# EAGLE design CC3000_WiFi_Shield (EAGLE 6.5.0)
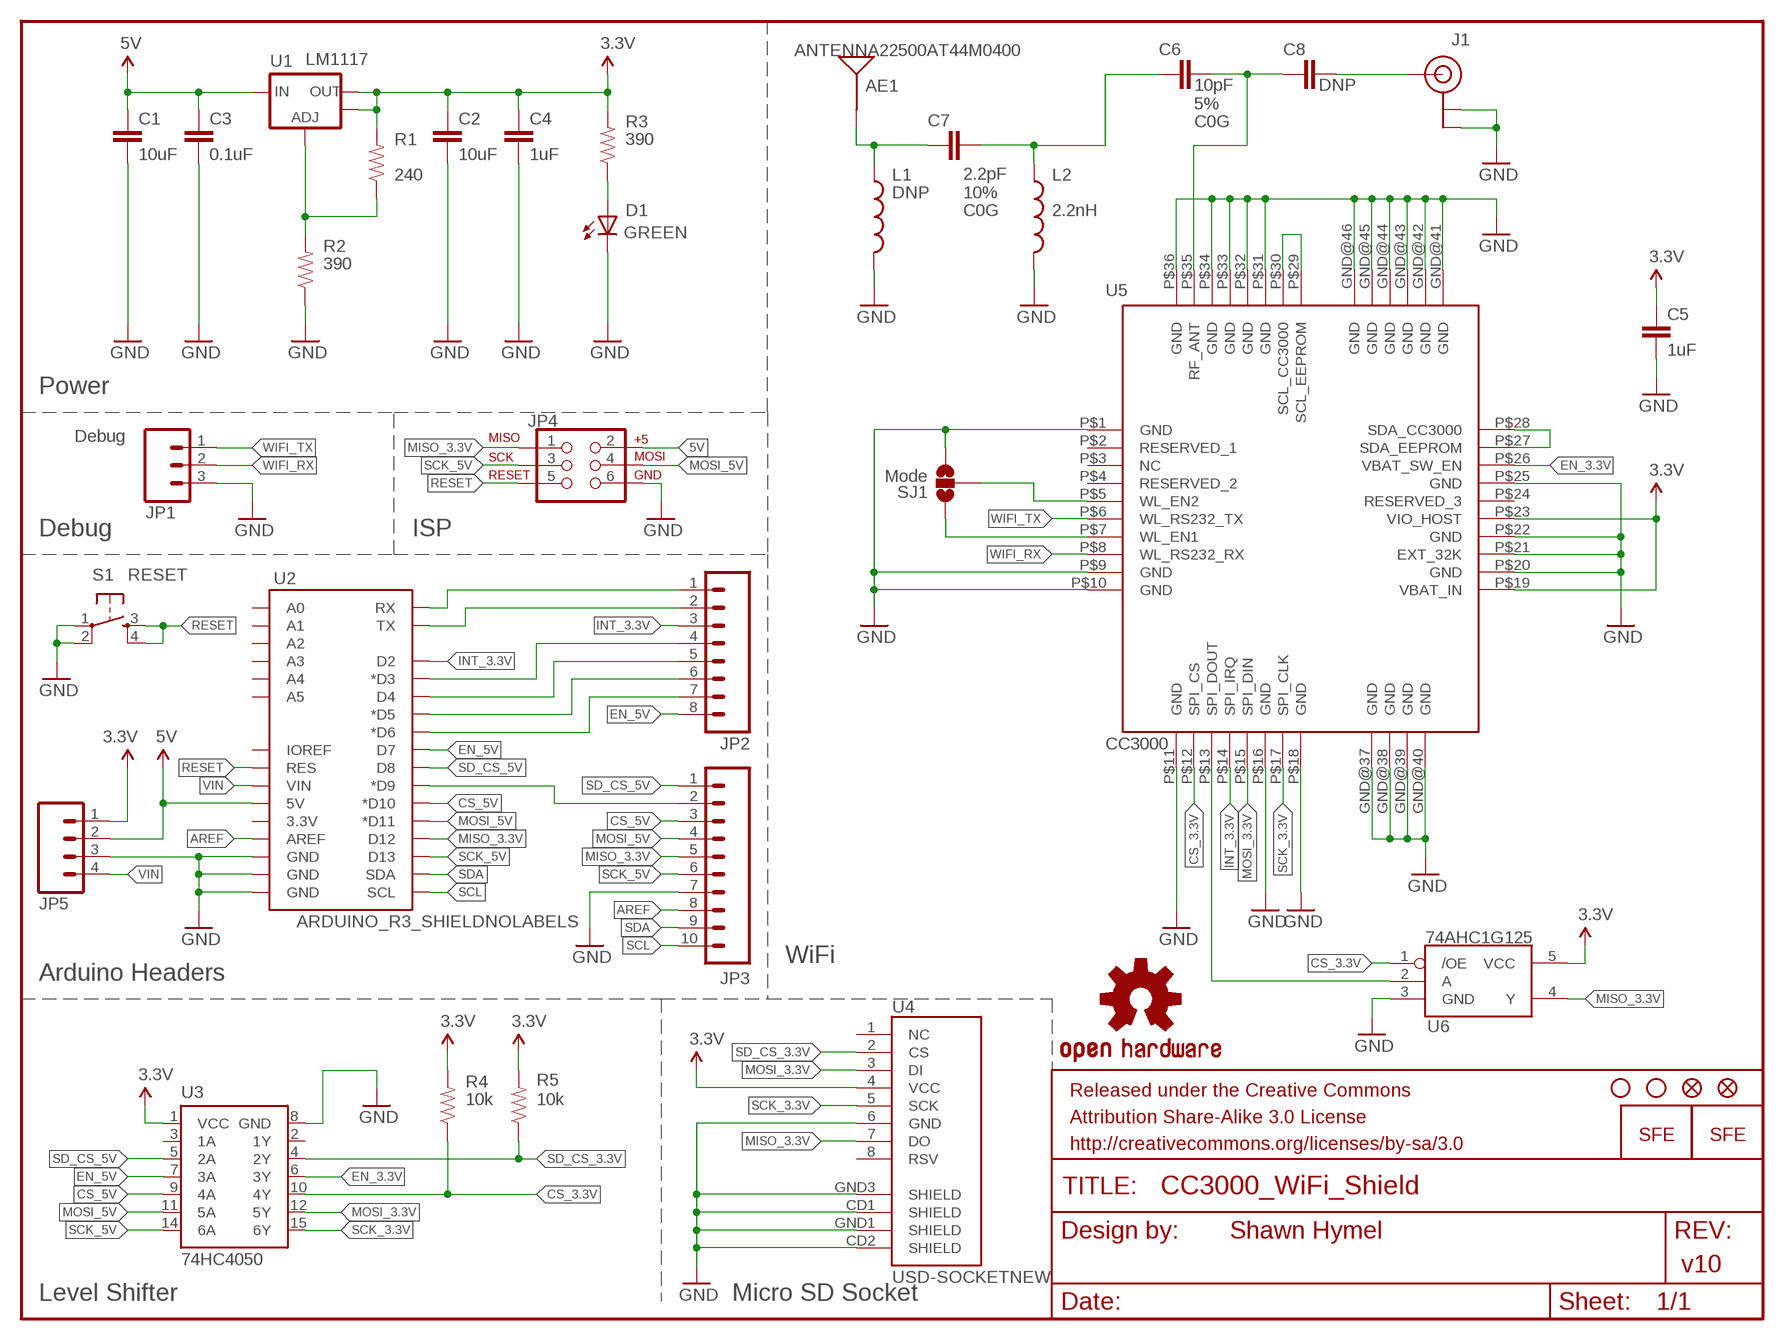
[diagram p0: schematic, sheet 1]

## Parts
AE1  ANTENNA22500AT44M0400  [ANTENNA-CHIP_2500AT44M0400]
C1  10uF  CAP0805  [0805]
C2  10uF  CAP0805  [0805]
C3  0.1uF  CAP0603-CAP  [0603-CAP]
C4  1uF  CAP0805  [0805]
C5  1uF  CAP0805  [0805]
C6  10pF  CAP0603-CAP  [0603-CAP]
C7  2.2pF  CAP0603-CAP  [0603-CAP]
C8  DNP  CAP0603-CAP  [0603-CAP]
D1  GREEN  LED-GREEN0603  [LED-0603]
FID1  FIDUCIAL1X2  [FIDUCIAL-1X2]
FID2  FIDUCIAL1X2  [FIDUCIAL-1X2]
FRAME1  FRAME-LETTER  [CREATIVE_COMMONS]
J1  U.FL  [U.FL]
JP1  Debug  M03PTH  [1X03]
JP2  M08NO_SILK  [1X08_NO_SILK]
JP3  M10NO_SILK  [1X10_NO_SILK]
JP4  AVR_SPI_PRG_6PTH  [2X3]
JP5  M04PTH  [1X04]
L1  DNP  INDUCTOR0603  [0603]
L2  2.2nH  INDUCTOR0603  [0603]
LOGO1  OSHW-LOGOS  [OSHW-LOGO-S]
LOGO2  LOGO-SFENEW  [SFE-NEW-WEBLOGO]
LOGO3  LOGO-SFESK  [SFE-LOGO-FLAME]
R1  240  RESISTOR0603  [0603-RES]
R2  390  RESISTOR0603  [0603-RES]
R3  390  RESISTOR0603-RES  [0603-RES]
R4  10k  RESISTOR0603-RES  [0603-RES]
R5  10k  RESISTOR0603-RES  [0603-RES]
S1  RESET  TAC_SWITCHSMD  [TACTILE_SWITCH_SMD]
SJ1  Mode  SOLDERJUMPER_2WAYPASTE1&2  [SJ_3_PASTE1&2]
STANDOFF1  STAND-OFF  [STAND-OFF]
STANDOFF2  STAND-OFF  [STAND-OFF]
U1  LM1117  V_REG_LM1117SOT223  [SOT223]
U2  ARDUINO_R3_SHIELDNOLABELS  [UNO_R3_SHIELD_NOLABELS]
U3  74HC4050  HEX_CONVERTER  [SO016]
U4  USD-SOCKETNEW  [MICRO-SD-SOCKET-PP]
U5  CC3000  [QFN-46_CC3000]
U6  74AHC1G125  [SOT23-5]

## Nets
3.3V: C2.1 C4.1 C5.1 JP5.1 R1.2 R3.2 R4.2 R5.2 U1.2(OUT) U1.4(OUT) U3.1(VCC) U4.4(VCC) U5.P$19(VBAT_IN) U5.P$23(VIO_HOST) U6.5(VCC)
5V: C1.1 C3.1 JP4.2 JP5.2 U1.3(IN) U2.5V
AREF: JP3.8 U2.AREF
CS_3.3V: R4.1 U3.10(4Y) U5.P$12(SPI_CS) U6.1(/OE)
CS_5V: JP3.3 U2.D10(*D10) U3.9(4A)
EN_3.3V: U3.6(3Y) U5.P$26(VBAT_SW_EN)
EN_5V: JP2.8 U2.D7 U3.7(3A)
GND: C1.2 C2.2 C3.2 C4.2 C5.2 D1.C J1.P$1(GND) J1.P$2(GND) JP1.3 JP3.7 JP4.6 JP5.3 L1.2 L2.2 R2.1 S1.1 S1.2 SJ1.3 U2.GND@0(GND) U2.GND@1(GND) U2.GND@2(GND) U3.8(GND) U4.6(GND) U4.CD1(SHIELD) U4.CD2(SHIELD) U4.GND1(SHIELD) U4.GND3(SHIELD) U5.GND@37(GND) U5.GND@38(GND) U5.GND@39(GND) U5.GND@40(GND) U5.GND@41(GND) U5.GND@42(GND) U5.GND@43(GND) U5.GND@44(GND) U5.GND@45(GND) U5.GND@46(GND) U5.P$1(GND) U5.P$9(GND) U5.P$10(GND) U5.P$11(GND) U5.P$16(GND) U5.P$18(GND) U5.P$20(GND) U5.P$21(EXT_32K) U5.P$22(GND) U5.P$25(GND) U5.P$31(GND) U5.P$32(GND) U5.P$33(GND) U5.P$34(GND) U5.P$36(GND) U6.3(GND)
INT_3.3V: JP2.3 U2.D2 U5.P$14(SPI_IRQ)
MISO_3.3V: JP3.5 JP4.1 U2.D12 U4.7(DO) U6.4(Y)
MOSI_3.3V: U3.12(5Y) U4.3(DI) U5.P$15(SPI_DIN)
MOSI_5V: JP3.4 JP4.4 U2.D11(*D11) U3.11(5A)
N$2: R1.1 R2.2 U1.1(ADJ)
N$3: SJ1.2 U5.P$5(WL_EN2)
N$4: SJ1.1 U5.P$7(WL_EN1)
N$5: C6.1 C7.2 L2.1
N$6: U5.P$27(SDA_EEPROM) U5.P$28(SDA_CC3000)
N$7: U5.P$29(SCL_EEPROM) U5.P$30(SCL_CC3000)
N$8: C6.2 C8.1 U5.P$35(RF_ANT)
N$9: C8.2 J1.P$3(SIGNAL)
N$10: AE1.FEED(SIGNAL) C7.1 L1.1
N$11: D1.A R3.1
N$125: JP2.1 U2.RX
N$126: JP2.2 U2.TX
N$127: JP2.4 U2.D3(*D3)
N$128: JP2.6 U2.D5(*D5)
N$129: JP2.7 U2.D6(*D6)
N$130: JP2.5 U2.D4
N$131: JP3.2 U2.D9(*D9)
RESET: JP4.5 S1.3 S1.4 U2.RES
SCK_3.3V: U3.15(6Y) U4.5(SCK) U5.P$17(SPI_CLK)
SCK_5V: JP3.6 JP4.3 U2.D13 U3.14(6A)
SCL: JP3.10 U2.SCL
SD_CS_3.3V: R5.1 U3.4(2Y) U4.2(CS)
SD_CS_5V: JP3.1 U2.D8 U3.5(2A)
SDA: JP3.9 U2.SDA
VIN: JP5.4 U2.VIN
WIFI_MISO: U5.P$13(SPI_DOUT) U6.2(A)
WIFI_RX: JP1.2 U5.P$8(WL_RS232_RX)
WIFI_TX: JP1.1 U5.P$6(WL_RS232_TX)
Unconnected: U2.3.3V U2.A0 U2.A1 U2.A2 U2.A3 U2.A4 U2.A5 U2.IOREF U3.2(1Y) U3.3(1A) U4.1(NC) U4.8(RSV) U5.P$2(RESERVED_1) U5.P$3(NC) U5.P$4(RESERVED_2) U5.P$24(RESERVED_3)

## Notes on the sheet
- Power
- Debug | ISP
- WiFi
- Arduino Headers
- Shawn Hymel
- v10
- Level Shifter | Micro SD Socket

## Library data of the parts
AE1 = SparkFun-RF:ANTENNA2: Chip antenna Single endded antenna. Common with smaller chip antennas. CHIP4 package is the GPS Chip Antenna SKU: GPS-08418. CHIP5 package is 2.4GHz chip antenna SKU: WRL-00144.
C1-C5 C8 = SparkFun-Capacitors:CAP: Capacitor Standard 0603 ceramic capacitor, and 0.1" leaded capacitor.
C6 = SparkFun-Capacitors:CAP: Capacitor Standard 0603 ceramic capacitor, and 0.1" leaded capacitor.; COEFF: C0G; TOL: 5%
C7 = SparkFun-Capacitors:CAP: Capacitor Standard 0603 ceramic capacitor, and 0.1" leaded capacitor.; COEFF: C0G; TOL: 10%
D1 = SparkFun-LED:LED-GREEN: Various green LEDs 0603- DIO-00821 LARGE- DIO-00862 LILYPAD- DIO-09910; PROD_ID: DIO-00821
FID1 FID2 = SparkFun-Aesthetics:FIDUCIAL: Fiducial Alignment Points Various fiducial points for machine vision alignment.
FRAME1 = SparkFun-Aesthetics:FRAME-LETTER: Schematic Frame Standard 8.5x11 US Letter frame
J1 = SparkFun-Connectors:U.FL: SMD antenna connector- WRL-09144
JP1 = SparkFun-Connectors:M03: Header 3 Standard 3-pin 0.1" header. Use with straight break away headers (SKU : PRT-00116), right angle break away headers (PRT-00553), swiss pins (PRT-00743), machine pins (PRT-00117), and female headers (PRT-00115). Molex polarized connector foot print use with SKU : PRT-08232 with associated crimp pins and housings.
JP2 = SparkFun-Connectors:M08: Header 8 Standard 8-pin 0.1" header. Use with straight break away headers (SKU : PRT-00116), right angle break away headers (PRT-00553), swiss pins (PRT-00743), machine pins (PRT-00117), and female headers (PRT-00115).
JP3 = SparkFun-Connectors:M10: Header 10 Standard 10-pin 0.1" header. Use with straight break away headers (SKU : PRT-00116), right angle break away headers (PRT-00553), swiss pins (PRT-00743), machine pins (PRT-00117), and female headers (PRT-00115).
JP4 = SparkFun-Connectors:AVR_SPI_PRG_6: AVR ISP 6 Pin This is the reduced ISP connector for AVR programming. Common on Arduino. This footprint will take up less PCB space and can be used with a 10-pin to 6-pin adapter such as SKU: BOB-08508
JP5 = SparkFun-Connectors:M04: Header 4 Standard 4-pin 0.1" header. Use with straight break away headers (SKU : PRT-00116), right angle break away headers (PRT-00553), swiss pins (PRT-00743), machine pins (PRT-00117), and female headers (PRT-00115). Molex polarized connector foot print use with SKU : PRT-08231 with associated crimp pins and housings. 1MM SMD Version SKU: PRT-10208
L1 L2 = SparkFun-Passives:INDUCTOR: Inductors Basic Inductor/Choke - 0603 and 1206. Footprints are not proven and vary greatly between part numbers. SRN6045- 33uH, 20% 1.4A SDR0403-560KL - 56uH, 10%, 500mA RMS/740mA peak
LOGO1 = SparkFun-Aesthetics:OSHW-LOGO: Open Source Hardware Logo This logo indicates the piece of hardware it is found on incorporates a OSHW license and/or adheres to the definition of open source hardware found here: http://freedomdefined.org/OSHW
LOGO2 LOGO3 = SparkFun-Aesthetics:LOGO-SFE: Spark Fun Electronics PCB Logo This is the standard Spark Fun Electronics PCB logo.
R1-R5 = SparkFun-Resistors:RESISTOR: Resistor Basic schematic elements and footprints for 0603, 1206, and PTH resistors.
S1 = SparkFun-Electromechanical:TAC_SWITCH: Momentary Switch Button commonly used for reset or general input. Spark Fun Electronics SKU : COM-00097 SMT- SWCH-08247; PROD_ID: SWCH-08247
SJ1 = SparkFun-Passives:SOLDERJUMPER_2WAY: Solder Jumper 2 way solder jumper
STANDOFF1 STANDOFF2 = SparkFun-Electromechanical:STAND-OFF: #4 Stand Off This is the mechanical footprint for a #4 phillips button head screw. Use the keepout ring to avoid running the screw head into surrounding components. SKU : PRT-00447
U1 = SparkFun-PowerIC:V_REG_LM1117: Voltage Regulator LM1117 Standard adjustable voltage regulator but in SMD form. Spark Fun Electronics SKU : COM-00595
U2 = SparkFun-Boards:ARDUINO_R3_SHIELD: Shield form compatible with the Arduino Uno R3.
U3 = SparkFun-DigitalIC:HEX_CONVERTER: Just what it says.
U4 = SparkFun-Connectors:USD-SOCKET: microSD Socket Push-push type uSD socket. Schematic element and footprint production proven. Spark Fun Electronics SKU : PRT-00127. tDoc lines correctly indicate media card edge positions when inserting (unlocked, locked, depressed).
U5 = SparkFun-RF:CC3000: TI CC3000 WiFi Module
U6 = SparkFun-DigitalIC:74AHC1G125: Single bus buffer gate with 3-state output

## Board
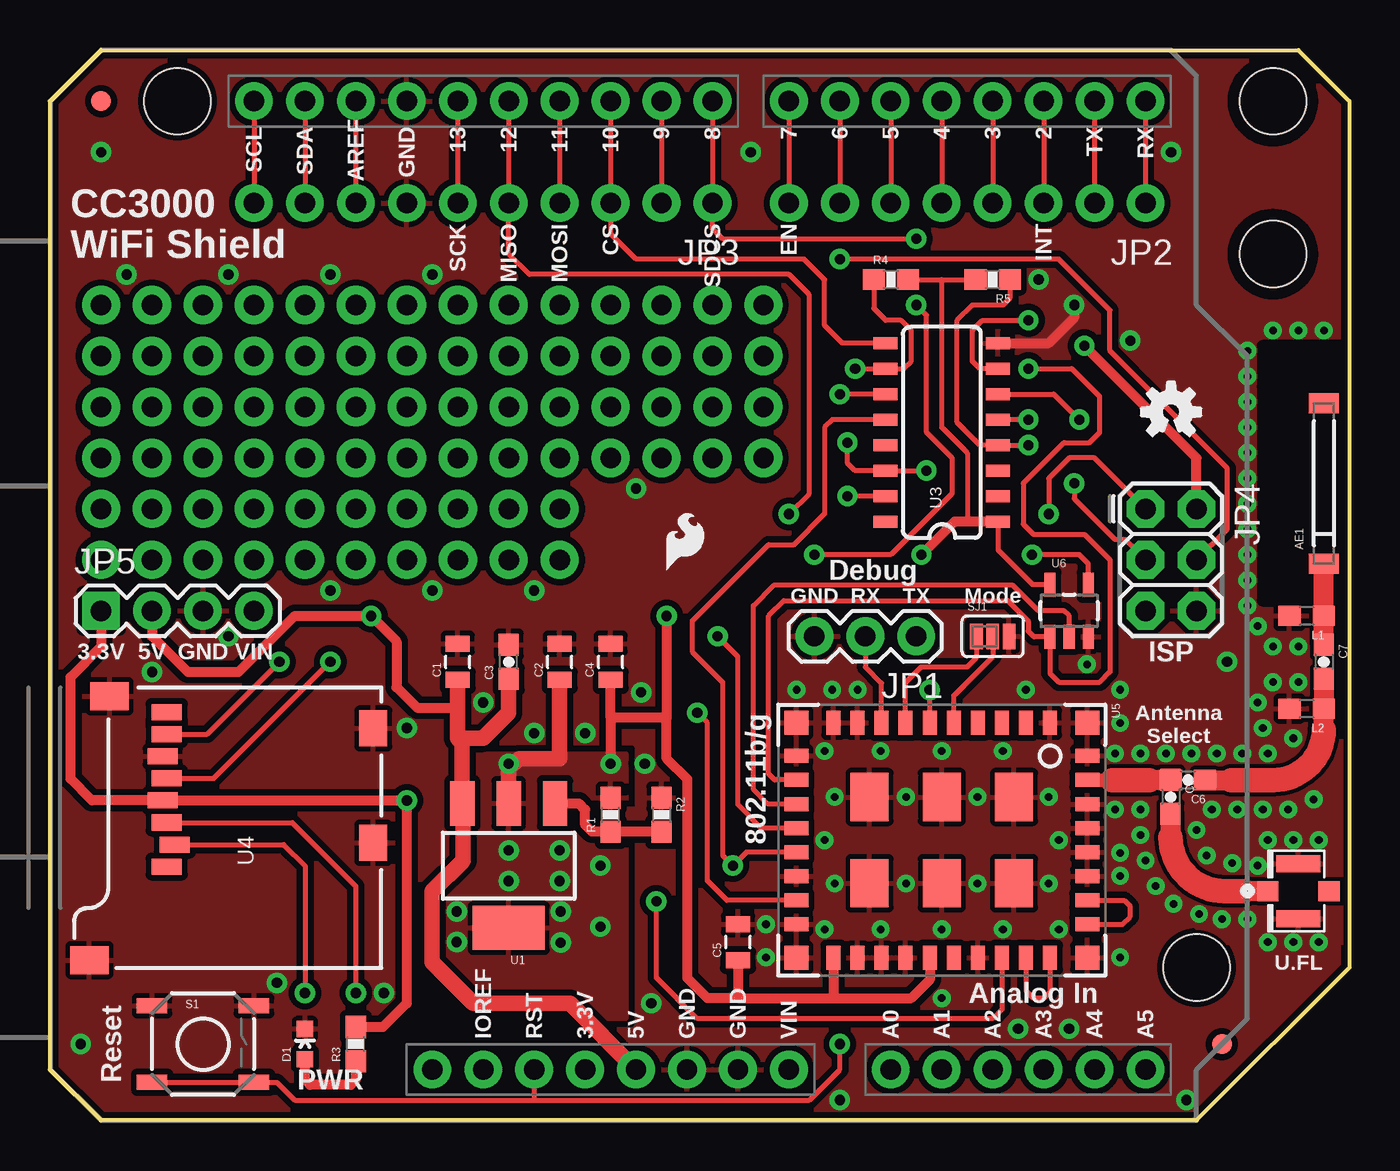
[diagram p1: board, top side]
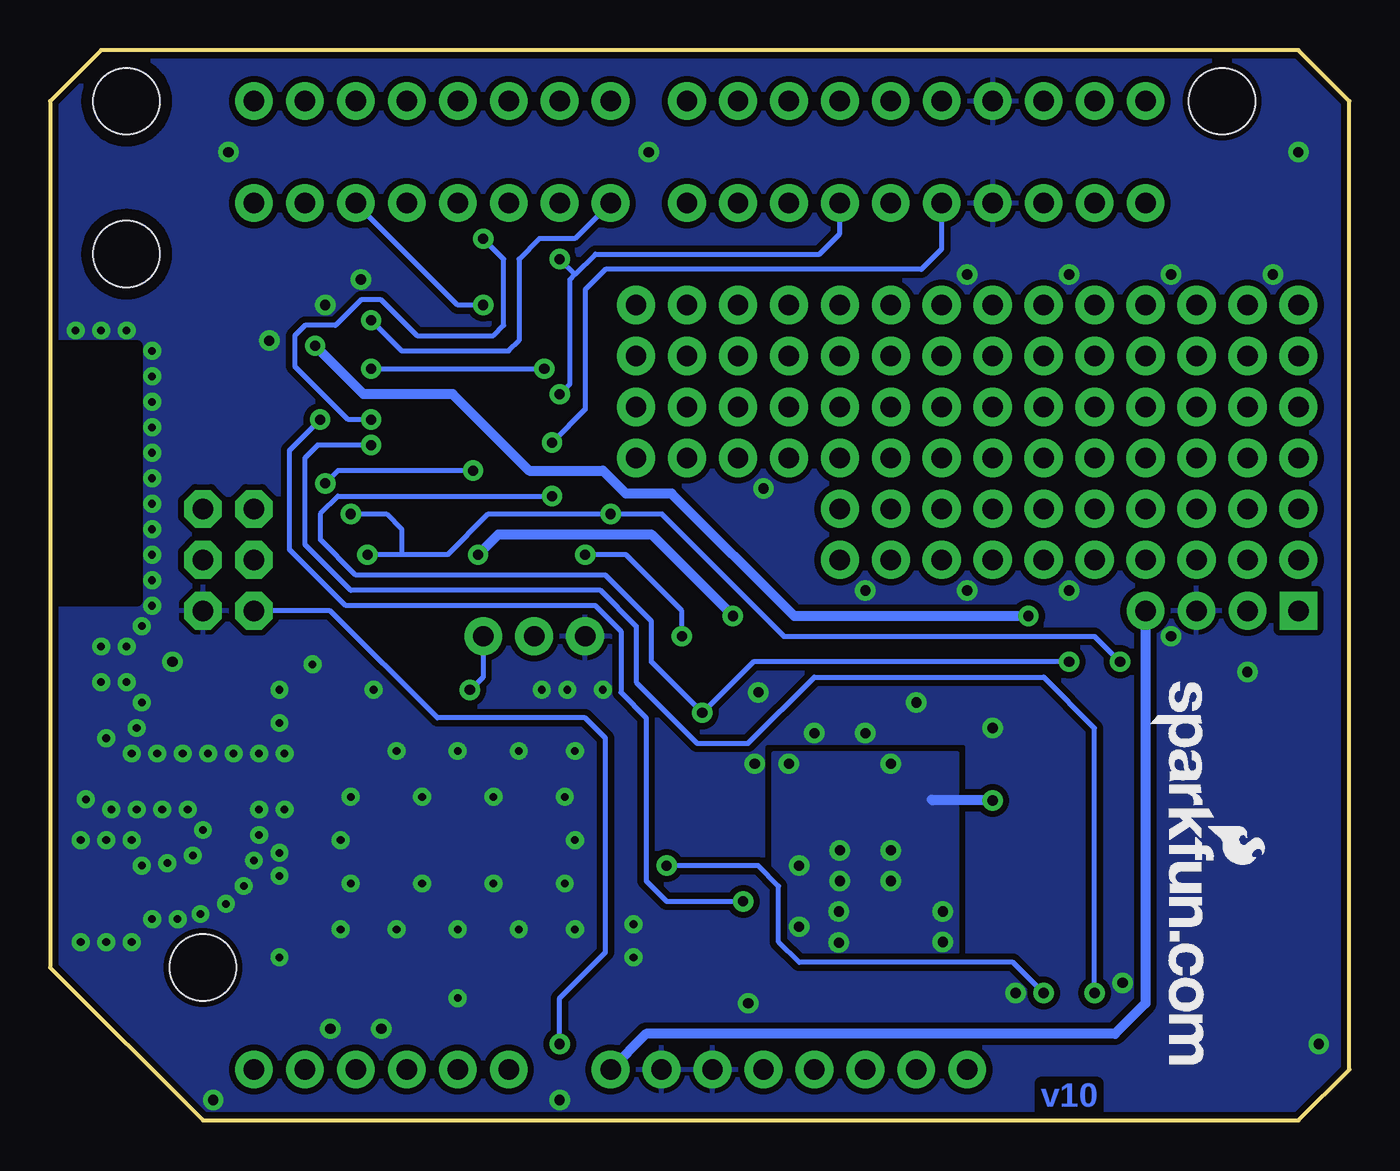
[diagram p2: board, bottom side, seen from below]

Size 64.77 x 53.34 mm. Coordinates in mm from the lower left corner, seen from the top.
Outline: 0,2.54 0,50.8 2.54,53.34 62.23,53.34 64.77,50.8 64.77,7.62 57.15,0 2.54,0 0,2.54
Copper layers (1*16): Top 0.035mm / dielectric 1.5mm / Bottom 0.035mm
Design rules "SparkFun-2-layer": minimum track width 7mil, minimum drill 15mil, track to track 8mil, track to pad 8mil, pad to pad 8mil, via to via 8mil, smd to smd 8mil, copper to edge 8mil, drill to drill 8mil, minimum pad ring 12mil, minimum via ring 10mil, stop-mask expansion 4mil, vias tented up to drill 20mil, thermal gap 10mil
Holes 3.3 mm at 6.35,50.8 57.15,7.62
tRestrict: area 61.5,10.7 to 63,12.2; area 60.5,36.6 to 64.3,38.6; area 60.5,25.9 to 62.5,38.6; area 62.5,28.4 to 64.3,35.1
bRestrict: area 60.5,25.9 to 64.3,38.6

### Footprints (pad centres in the part's own frame; a part is rotated, then mirrored left to right if it is on the bottom)
ANTENNA-CHIP_2500AT44M0400 = smd 1 x 1.5: FEED -4,0; NC 4,0
0805 = smd 0.8 x 1.2: 1 -0.9,0; 2 0.9,0
0603-CAP = smd 1.1 x 1: 1 -0.85,0; 2 0.85,0
LED-0603 = smd 0.8 x 0.8: A 0,-0.75; C 0,0.75
FIDUCIAL-1X2 = smd 1 x 1: 1 0,0
U.FL = smd 2.2 x 0.85: P$1 0,1.375; P$2 0,-1.375 | smd 1.05 x 1: P$3 1.525,0; P$4 -1.525,0
1X03 = drill 1.016 pad 1.88: 1 0,0; 2 2.54,0; 3 5.08,0
1X08_NO_SILK = drill 1.016 pad 1.88: 1 0,0; 2 2.54,0; 3 5.08,0; 4 7.62,0; 5 10.16,0; 6 12.7,0; 7 15.24,0; 8 17.78,0
1X10_NO_SILK = drill 1.016 pad 1.88: 1 0,0; 2 2.54,0; 3 5.08,0; 4 7.62,0; 5 10.16,0; 6 12.7,0; 7 15.24,0; 8 17.78,0; 9 20.32,0; 10 22.86,0
2X3 = drill 1.016 pad 1.88 octagon: 1 0,0; 2 0,2.54; 3 2.54,0; 4 2.54,2.54; 5 5.08,0; 6 5.08,2.54
1X04 = drill 1.016 pad 1.88 square: 1 0,0 | drill 1.016 pad 1.88: 2 2.54,0; 3 5.08,0; 4 7.62,0
0603 = smd 1.1 x 1: 1 -0.85,0; 2 0.85,0
0603-RES = smd 1.1 x 1: 1 -0.85,0; 2 0.85,0
TACTILE_SWITCH_SMD = smd 1.524 x 0.762: 1 -2.54,1.905; 2 2.54,1.905; 3 -2.54,-1.905; 4 2.54,-1.905
SJ_3_PASTE1&2 = smd 0.635 x 1.27: 1 -0.813,0; 2 0,0; 3 0.813,0
STAND-OFF = hole 3.302: 0,0
SOT223 = smd 1.219 x 2.235: 1 -2.311,-3.099; 2 0,-3.099; 3 2.311,-3.099 | smd 3.6 x 2.2: 4 0,3.099
UNO_R3_SHIELD_NOLABELS = drill 1.016 pad 1.88: 3.3V 50.8,26.67; 5V 50.8,29.21; A0 50.8,41.91; A1 50.8,44.45; A2 50.8,46.99; A3 50.8,49.53; A4 50.8,52.07; A5 50.8,54.61; AREF 2.54,15.24; D2 2.54,49.53; D3 2.54,46.99; D4 2.54,44.45; D5 2.54,41.91; D6 2.54,39.37; D7 2.54,36.83; D8 2.54,33.02; D9 2.54,30.48; D10 2.54,27.94; D11 2.54,25.4; D12 2.54,22.86; D13 2.54,20.32; GND@0 50.8,31.75; GND@1 50.8,34.29; GND@2 2.54,17.78; IOREF 50.8,21.59; NC 50.8,19.05; RES 50.8,24.13; RX 2.54,54.61; SCL 2.54,10.16; SDA 2.54,12.7; TX 2.54,52.07; VIN 50.8,36.83
SO016 = smd 0.6 x 1.2: 1 -4.445,-2.8; 2 -3.175,-2.8; 3 -1.905,-2.8; 4 -0.635,-2.8; 5 0.635,-2.8; 6 1.905,-2.8; 7 3.175,-2.8; 8 4.445,-2.8; 9 4.445,2.8; 10 3.175,2.8; 11 1.905,2.8; 12 0.635,2.8; 13 -0.635,2.8; 14 -1.905,2.8; 15 -3.175,2.8; 16 -4.445,2.8
MICRO-SD-SOCKET-PP = smd 0.8 x 1.5: 1 -8.94,10.7; 2 -7.84,10.3; 3 -6.74,10.7; 4 -5.64,10.9; 5 -4.54,10.7; 6 -3.44,10.9; 7 -2.34,10.7; 8 -1.24,10.7 | smd 1.8 x 1.4: CD1 -2.05,0.4; CD2 -7.75,0.4 | smd 1.4 x 1.9: GND1 -13.6,14.55; GND3 -0.45,13.55
QFN-46_CC3000 = smd 2.4 x 1.9: GND@37 -2.15,3.6; GND@38 -2.15,0; GND@39 -2.15,-3.6; GND@40 2.15,3.6; GND@41 2.15,0; GND@42 2.15,-3.6 | smd 1.2 x 1.2: GND@43 -5.85,7.25; GND@44 -5.85,-7.25; GND@45 5.85,-7.25; GND@46 5.85,7.25 | smd 1.2 x 0.7: P$1 -5.85,5.4; P$2 -5.85,4.2; P$3 -5.85,3; P$4 -5.85,1.8; P$5 -5.85,0.6; P$6 -5.85,-0.6; P$7 -5.85,-1.8; P$8 -5.85,-3; P$9 -5.85,-4.2; P$10 -5.85,-5.4; P$19 5.85,-5.4; P$20 5.85,-4.2; P$21 5.85,-3; P$22 5.85,-1.8; P$23 5.85,-0.6; P$24 5.85,0.6; P$25 5.85,1.8; P$26 5.85,3; P$27 5.85,4.2; P$28 5.85,5.4 | smd 0.7 x 1.2: P$11 -4.2,-7.25; P$12 -3,-7.25; P$13 -1.8,-7.25; P$14 -0.6,-7.25; P$15 0.6,-7.25; P$16 1.8,-7.25; P$17 3,-7.25; P$18 4.2,-7.25; P$29 4.2,7.25; P$30 3,7.25; P$31 1.8,7.25; P$32 0.6,7.25; P$33 -0.6,7.25; P$34 -1.8,7.25; P$35 -3,7.25; P$36 -4.2,7.25
SOT23-5 = smd 0.55 x 1.2: 1 -0.95,-1.3; 2 0,-1.3; 3 0.95,-1.3; 4 0.95,1.3; 5 -0.95,1.3

### Placement (x,y rotation side)
AE1  63.5,31.75 90 top
C1  20.32,22.86 90 top
C2  25.4,22.86 90 top
C3  22.86,22.86 90 top
C4  27.94,22.86 90 top
C5  34.29,8.89 90 top
C6  56.72,16.97 180 top
C7  63.5,22.86 270 top
C8  55.85,16.13 270 top
D1  12.7,3.81 0 top
FID1  58.42,3.81 0 top
FID2  2.54,50.8 0 top
FRAME1  0,-16.51 0 top  (outside the outline)
J1  62.23,11.43 180 top
JP1  43.18,24.13 180 top
JP2  54.61,45.72 180 top
JP3  33.02,45.72 180 top
JP4  54.61,30.48 270 top
JP5  2.54,25.4 0 top
L1  62.64,25.15 180 top
L2  62.64,20.52 180 top
LOGO1  55.88,35.31 0 top
LOGO2  9.91,21.84 270 bottom
LOGO3  30.73,27.43 0 top
R1  27.94,15.24 90 top
R2  30.48,15.24 270 top
R3  15.24,3.81 90 top
R4  41.91,41.91 0 top
R5  46.99,41.91 180 top
S1  7.62,3.81 0 top
SJ1  46.99,24.13 0 top
STANDOFF1  60.96,50.8 0 top
STANDOFF2  60.96,43.18 0 top
U1  22.86,12.7 180 top
U2  0,53.34 270 top
U3  44.45,34.29 90 top
U4  16.51,21.59 90 top
U5  44.45,13.97 270 top
U6  50.8,25.4 0 top

### Tracks (layer width: path | path; a pad name or v marks a point on that pad's centre or on a via)
3.3V  (via drill 0.51)
  Top 0.254: R4.2 44.45,41.91 | 44.45,41.91 R5.2 | U3.1 47.25,28.44 48.99,26.7 U6.5 | 45.72,29.84 45.72,33.27 44.45,34.54 44.45,41.91
  Top 0.508: 39.12,6.1 42.93,6.1 43.85,7.02 U5.P$23 | U5.P$19 39.05,6.16 39.12,6.1 | 34.29,6.1 39.12,6.1 | C5.1 34.29,6.1 | 34.29,6.1 32.77,6.1 31.75,7.11 31.75,17.02 30.73,18.03 30.73,20.07 | v30.73,25.15 30.73,20.07 | 27.94,20.07 C4.1 | 27.94,16 R1.2 | 30.73,20.07 27.94,20.07 | 27.94,20.07 v27.94,17.78 | v43.43,28.19 45.09,29.84 45.72,29.84 U3.1 | R3.2 16.6,4.66 17.78,5.84 v17.78,15.95 U4.4 2.08,15.95 1.02,17.02 1.02,22.1 2.54,23.62 JP5.1
  Top 0.762: U1.2 22.86,17.53 23.37,18.03 25.4,18.03 C2.1
  Bottom 0.508: v17.78,15.95 20.78,15.95 20.83,16 | v30.73,25.15 34.8,29.21 42.42,29.21 v43.43,28.19
  other vias: 20.27,10.41 20.27,8.89 25.45,10.41 25.45,8.86 22.86,13.46 22.86,11.94 25.4,11.94 25.4,13.46 22.86,17.78 27.43,9.65 27.43,12.7
  pour Bottom (isolate 0.305): 19.56,8.13 19.56,18.29 28.7,18.29 28.7,8.13
  pour Top (isolate 0.305): 19.56,5.08 19.56,18.29 28.7,18.29 28.7,5.08
5V  (via drill 0.51)
  Top 0.508: JP5.2 5.08,24.13 6.86,22.35 9.4,22.35 12.19,25.15 v16,25.15 17.27,23.88 17.27,21.59 18.29,20.57 20.32,20.57 | JP4.2 57.15,33.02 v51.56,38.61
  Top 0.762: U2.5V 25.91,5.84 21.08,5.84 19.05,7.87 19.05,11.43 20.57,12.95 20.57,15.77 U1.3 20.55,18.82 20.32,19.05 | C1.1 20.32,20.57 20.32,19.05 | C3.1 22.86,20.32 21.59,19.05 20.32,19.05
  Bottom 0.508: v16,25.15 27.69,25.15 33.78,31.24 36.07,31.24 37.21,32.38 40.89,32.38 44.7,36.2 49.15,36.2 v51.56,38.61
AREF
  Top 0.254: U2.AREF JP3.8
CS_3.3V  (via drill 0.51)
  Top 0.254: R4.1 41.06,40.47 41.66,39.88 42.42,39.88 42.93,39.37 42.93,37.85 42.55,37.47 U3.10 v40.13,37.47 | v48.77,37.47 50.93,37.47 52.32,36.07 52.32,34.29 51.82,33.78 50.55,33.78 48.51,31.75 48.51,29.72 49.02,29.21 51.56,29.21 52.83,27.94 52.83,22.35 52.32,21.84 50.29,21.84 49.85,22.29 U6.1 49.05,24.1 48.77,24.38 48.77,24.89 47.75,25.91 36.58,25.91 35.81,25.15 35.81,17.27 36.12,16.97 U5.P$12
  Bottom 0.254: v48.77,37.47 v40.13,37.47
CS_5V
  Top 0.254: U3.9 39.5,38.73 38.61,39.62 38.61,41.91 37.59,42.93 29.21,42.93 27.94,44.2 JP3.3 U2.D10
EN_3.3V  (via drill 0.51)
  Top 0.254: U5.P$26 47.45,5.54 46.99,5.08 32.26,5.08 30.23,7.11 v30.23,10.92 | U3.6 50.04,36.2 v51.31,34.92
  Bottom 0.254: v30.23,10.92 34.04,10.92 35.05,11.94 35.05,20.07 36.32,21.34 36.32,24.38 37.59,25.65 50.04,25.65 52.83,28.45 52.83,33.4 v51.31,34.92
EN_5V  (via drill 0.51)
  Top 0.254: U3.7 46.35,37.47 45.97,37.85 45.97,39.37 46.48,39.88 v48.77,39.88 | U2.D7 JP2.8
  Bottom 0.254: v48.77,39.88 47.24,38.35 41.91,38.35 41.4,38.86 41.4,42.93 40.39,43.94 38.61,43.94 JP2.8
GND  (via drill 0.38, 0.51)
  Top 0.508: U3.8 49.78,38.73 51.05,40.01 v51.05,40.64
  other vias: 62.23,39.37 60.96,39.37 59.69,38.35 59.69,37.08 59.69,35.81 59.69,34.54 59.69,33.27 59.69,32 59.69,30.73 59.69,29.46 59.69,28.19 59.69,26.92 59.69,25.65 60.71,18.29 59.44,18.29 58.17,18.29 56.9,18.29 55.63,18.29 54.36,18.29 53.09,18.29 53.09,15.49 54.36,15.49 54.36,14.22 54.61,12.95 55.12,11.68 56.01,10.79 59.69,10.03 63.25,8.89 61.98,8.89 60.71,8.89 60.45,15.49 59.18,15.49 57.91,15.49 57.15,14.48 57.66,13.21 58.93,12.83 60.2,12.7 60.71,13.97 61.98,13.97 39.12,16.13 42.67,16.13 46.23,16.13 49.78,16.13 39.12,11.81 42.67,11.81 46.23,11.81 49.78,11.81 38.61,18.41 50.29,9.53 38.61,9.53 44.45,18.41 44.45,9.53 38.61,13.97 50.29,13.97 41.4,18.41 47.5,18.41 47.5,9.53 41.4,9.53 40.26,21.46 37.21,21.46 53.34,19.81 38.99,21.46 53.34,13.34 53.34,12.19 53.34,8.13 44.45,6.1 35.69,8.13 35.69,9.78 58.67,22.86 1.52,3.81 13.97,42.16 2.54,48.26 55.88,48.26 3.81,42.16 60.2,24.64 62.23,23.62 62.23,21.84 61.98,19.05 60.45,19.56 60.96,21.84 60.96,23.62 61.72,15.49 62.99,16 63.25,13.97 57.28,10.29 58.42,10.03 60.2,20.83 29.64,17.78 29.46,21.34 63.5,39.37 29.21,31.5 19.05,42.16 8.89,42.16 34.92,48.26 24.13,26.42 19.05,26.42 13.97,26.42 17.78,19.56 29.97,5.84 39.37,1.02 50.8,4.57 48.26,4.57 56.64,1.02 49.28,41.91 53.85,38.86 26.67,19.3 24.13,19.3 21.59,20.83 8.89,24.13 5.08,22.35 16.64,6.35 51.69,22.73 48.64,21.46 53.34,21.46 11.3,6.86
  pour Top (isolate 0.305, rank 6): 0,50.8 2.54,53.34 62.23,53.34 64.77,50.8 64.77,7.62 57.15,0 2.54,0 0,2.54
  pour Top (isolate 0.203): 64.77,25.15 59.94,25.15 59.94,19.3 52.58,19.3 52.58,14.99 54.86,14.99 54.86,11.94 57.91,8.89 64.77,8.89
  pour Bottom (isolate 0.305, rank 6): 0,50.8 2.54,53.34 62.23,53.34 64.77,50.8 64.77,7.62 57.15,0 2.54,0 0,2.54
INT_3.3V  (via drill 0.51)
  Top 0.254: U5.P$14 35.47,14.57 34.29,15.75 34.29,23.11 v33.27,24.13 | v43.18,40.64 43.56,40.26 43.69,40.13 43.69,34.29 44.96,33.02 44.96,31.24 41.91,28.19 v38.1,28.19 | U2.D2 JP2.3
  Bottom 0.254: v33.27,24.13 33.27,25.4 36.07,28.19 v38.1,28.19 | v43.18,40.64 44.45,40.64 JP2.3
MISO_3.3V  (via drill 0.51)
  Top 0.254: U4.7 7.82,19.25 v11.43,22.86 | U2.D12 JP3.5 22.86,43.18 23.88,42.16 36.83,42.16 37.85,41.15 37.85,31.24 v36.83,30.23 | U6.4 51.75,27.75 51.31,28.19 v48.95,28.19 | JP4.1 52.07,33.02 50.8,33.02 49.78,32 v49.78,30.23
  Bottom 0.254: 47.24,28.19 44.96,28.19 42.93,30.23 v36.83,30.23 34.29,30.23 28.19,24.13 12.7,24.13 v11.43,22.86 | 47.24,28.19 v48.95,28.19 | v49.78,30.23 48.01,30.23 47.24,29.46 47.24,28.19
MOSI_3.3V  (via drill 0.51)
  Top 0.254: U4.3 12.07,14.85 15.24,11.68 v15.24,6.35 | U3.12 38.99,34.92 38.61,34.54 38.61,30.23 37.08,28.7 35.81,28.7 32,24.89 32,23.37 33.53,21.84 33.53,13.21 v34.04,12.7 34.71,13.37 U5.P$15
  Bottom 0.254: v34.04,12.7 29.46,12.7 28.45,11.68 28.45,8.89 27.43,7.87 16.76,7.87 v15.24,6.35
MOSI_5V  (via drill 0.51)
  Top 0.254: U3.11 v39.37,36.2 | U2.D11 JP3.4 | JP4.4 58.67,29.46 58.67,32.51 52.83,38.35 52.83,40.39 50.29,42.93 v39.37,42.93
  Bottom 0.254: v39.37,36.2 38.86,36.7 38.86,41.91 38.61,42.16 | 38.61,42.16 37.59,43.18 26.42,43.18 25.4,44.2 JP3.4 | v39.37,42.93 38.61,42.16
N$2
  Top 0.508: R2.2 R1.1 27.01,14.39 26.67,14.73 26.67,15.49 26.36,15.8 U1.1
N$3
  Top 0.254: U5.P$5 45.05,21.17 46.99,23.11 SJ1.2
N$4
  Top 0.254: U5.P$7 42.65,21.82 43.43,22.61 45.72,22.61 46.18,23.06 SJ1.1
N$5
  Top 0.991: C7.2 63.5,20.54 L2.1 63.5,19.48 | C6.1 58.88,16.97
  Top 1.219: 58.88,16.97 60.98,16.97 arc90 63.5,19.48
N$6
  Top 0.254: U5.P$27 48.65,6.47 49.02,6.1 49.53,6.1 49.85,6.42 U5.P$28
N$7
  Top 0.254: U5.P$30 53.55,10.97 53.85,10.67 53.85,10.16 53.46,9.77 U5.P$29
N$8
  Top 0.66: 52.96,16.97 U5.P$35
  Top 0.965: C8.1 C6.2
  Top 0.991: C6.2 54.79,16.97
  Top 1.219: 54.79,16.97 52.96,16.97
N$9
  Top 0.991: C8.2 55.85,14.12 | 59.51,11.43 J1.P$3
  Top 1.219: 55.85,14.12 arc90 58.55,11.43 59.51,11.43
N$10
  Top 0.991: C7.1 63.5,25.13 L1.1 63.49,27.74 AE1.FEED
N$11
  Top 0.508: R3.1 15.24,2.03 14.99,1.78 12.95,1.78 12.7,2.03 D1.A
N$17  (via drill 1.02 pad 1.91)
  other vias: 2.54,40.64
N$18  (via drill 1.02 pad 1.91)
  other vias: 2.54,38.1
N$19  (via drill 1.02 pad 1.91)
  other vias: 2.54,35.56
N$40  (via drill 1.02 pad 1.91)
  other vias: 35.56,33.02
N$41  (via drill 1.02 pad 1.91)
  other vias: 30.48,33.02
N$42  (via drill 1.02 pad 1.91)
  other vias: 33.02,33.02
N$43  (via drill 1.02 pad 1.91)
  other vias: 27.94,33.02
N$44  (via drill 1.02 pad 1.91)
  other vias: 25.4,33.02
N$45  (via drill 1.02 pad 1.91)
  other vias: 22.86,33.02
N$46  (via drill 1.02 pad 1.91)
  other vias: 20.32,33.02
N$47  (via drill 1.02 pad 1.91)
  other vias: 17.78,33.02
N$48  (via drill 1.02 pad 1.91)
  other vias: 12.7,33.02
N$49  (via drill 1.02 pad 1.91)
  other vias: 15.24,33.02
N$50  (via drill 1.02 pad 1.91)
  other vias: 10.16,33.02
N$51  (via drill 1.02 pad 1.91)
  other vias: 7.62,33.02
N$52  (via drill 1.02 pad 1.91)
  other vias: 5.08,33.02
N$53  (via drill 1.02 pad 1.91)
  other vias: 2.54,33.02
N$54  (via drill 1.02 pad 1.91)
  other vias: 5.08,35.56
N$55  (via drill 1.02 pad 1.91)
  other vias: 5.08,38.1
N$56  (via drill 1.02 pad 1.91)
  other vias: 5.08,40.64
N$57  (via drill 1.02 pad 1.91)
  other vias: 7.62,40.64
N$58  (via drill 1.02 pad 1.91)
  other vias: 7.62,38.1
N$59  (via drill 1.02 pad 1.91)
  other vias: 7.62,35.56
N$60  (via drill 1.02 pad 1.91)
  other vias: 10.16,35.56
N$61  (via drill 1.02 pad 1.91)
  other vias: 10.16,38.1
N$62  (via drill 1.02 pad 1.91)
  other vias: 10.16,40.64
N$63  (via drill 1.02 pad 1.91)
  other vias: 12.7,40.64
N$64  (via drill 1.02 pad 1.91)
  other vias: 12.7,38.1
N$65  (via drill 1.02 pad 1.91)
  other vias: 12.7,35.56
N$66  (via drill 1.02 pad 1.91)
  other vias: 15.24,35.56
N$67  (via drill 1.02 pad 1.91)
  other vias: 15.24,38.1
N$68  (via drill 1.02 pad 1.91)
  other vias: 15.24,40.64
N$69  (via drill 1.02 pad 1.91)
  other vias: 17.78,40.64
N$70  (via drill 1.02 pad 1.91)
  other vias: 17.78,38.1
N$71  (via drill 1.02 pad 1.91)
  other vias: 17.78,35.56
N$72  (via drill 1.02 pad 1.91)
  other vias: 20.32,35.56
N$73  (via drill 1.02 pad 1.91)
  other vias: 20.32,38.1
N$75  (via drill 1.02 pad 1.91)
  other vias: 22.86,40.64
N$76  (via drill 1.02 pad 1.91)
  other vias: 22.86,38.1
N$77  (via drill 1.02 pad 1.91)
  other vias: 22.86,35.56
N$78  (via drill 1.02 pad 1.91)
  other vias: 25.4,35.56
N$79  (via drill 1.02 pad 1.91)
  other vias: 25.4,38.1
N$80  (via drill 1.02 pad 1.91)
  other vias: 25.4,40.64
N$81  (via drill 1.02 pad 1.91)
  other vias: 27.94,40.64
N$82  (via drill 1.02 pad 1.91)
  other vias: 27.94,38.1
N$83  (via drill 1.02 pad 1.91)
  other vias: 27.94,35.56
N$84  (via drill 1.02 pad 1.91)
  other vias: 30.48,35.56
N$85  (via drill 1.02 pad 1.91)
  other vias: 30.48,40.64
N$86  (via drill 1.02 pad 1.91)
  other vias: 30.48,38.1
N$87  (via drill 1.02 pad 1.91)
  other vias: 33.02,40.64
N$88  (via drill 1.02 pad 1.91)
  other vias: 33.02,38.1
N$89  (via drill 1.02 pad 1.91)
  other vias: 33.02,35.56
N$90  (via drill 1.02 pad 1.91)
  other vias: 35.56,35.56
N$91  (via drill 1.02 pad 1.91)
  other vias: 35.56,38.1
N$92  (via drill 1.02 pad 1.91)
  other vias: 35.56,40.64
N$96  (via drill 1.02 pad 1.91)
  other vias: 25.4,30.48
N$97  (via drill 1.02 pad 1.91)
  other vias: 25.4,27.94
N$98  (via drill 1.02 pad 1.91)
  other vias: 22.86,27.94
N$99  (via drill 1.02 pad 1.91)
  other vias: 22.86,30.48
N$100  (via drill 1.02 pad 1.91)
  other vias: 20.32,30.48
N$101  (via drill 1.02 pad 1.91)
  other vias: 20.32,27.94
N$102  (via drill 1.02 pad 1.91)
  other vias: 17.78,27.94
N$103  (via drill 1.02 pad 1.91)
  other vias: 17.78,30.48
N$104  (via drill 1.02 pad 1.91)
  other vias: 15.24,30.48
N$105  (via drill 1.02 pad 1.91)
  other vias: 15.24,27.94
N$106  (via drill 1.02 pad 1.91)
  other vias: 12.7,27.94
N$107  (via drill 1.02 pad 1.91)
  other vias: 12.7,30.48
N$108  (via drill 1.02 pad 1.91)
  other vias: 10.16,30.48
N$109  (via drill 1.02 pad 1.91)
  other vias: 10.16,27.94
N$110  (via drill 1.02 pad 1.91)
  other vias: 7.62,27.94
N$111  (via drill 1.02 pad 1.91)
  other vias: 7.62,30.48
N$112  (via drill 1.02 pad 1.91)
  other vias: 5.08,30.48
N$113  (via drill 1.02 pad 1.91)
  other vias: 5.08,27.94
N$114  (via drill 1.02 pad 1.91)
  other vias: 2.54,27.94
N$115  (via drill 1.02 pad 1.91)
  other vias: 2.54,30.48
N$116  (via drill 1.02 pad 1.91)
  other vias: 20.32,40.64
N$125
  Top 0.254: U2.RX JP2.1
N$126
  Top 0.254: U2.TX JP2.2
N$127
  Top 0.254: U2.D3 JP2.4
N$128
  Top 0.254: U2.D5 JP2.6
N$129
  Top 0.254: U2.D6 JP2.7
N$130
  Top 0.254: U2.D4 JP2.5
N$131
  Top 0.254: U2.D9 JP3.2
RESET  (via drill 0.51)
  Top 0.254: S1.3 S1.4 11.3,1.91 12.19,1.02 24.13,1.02 | 24.13,1.02 37.85,1.02 39.37,2.54 v39.37,3.81 | U2.RES 24.13,1.02
  Bottom 0.254: v39.37,3.81 39.37,6.1 37.08,8.38 37.08,19.05 38.1,20.07 45.47,20.07 50.8,25.4 JP4.5
SCK_3.3V  (via drill 0.51)
  Top 0.254: U4.5 8.16,17.05 v13.97,22.86 | v32.26,20.32 32.77,19.81 32.77,11.94 33.73,10.97 U5.P$17 | U3.15 v39.75,31.11
  Bottom 0.254: v13.97,22.86 29.72,22.86 v32.26,20.32 34.8,22.86 34.8,24.89 37.08,27.18 49.53,27.18 51.31,28.96 51.31,30.23 50.42,31.11 v39.75,31.11
SCK_5V  (via drill 0.51)
  Top 0.254: 41.53,32.38 41.66,32.51 | 41.53,32.38 40.13,32.38 39.75,32.77 v39.75,33.78 | 41.53,32.38 U3.14 v43.69,32.38 | U2.D13 JP3.6 | JP4.3 53.59,28.96 53.09,28.96 51.05,30.99 v51.05,31.75
  Bottom 0.254: JP3.6 20.32,43.43 21.34,42.42 37.08,42.42 38.1,41.4 38.1,35.43 v39.75,33.78 | v43.69,32.38 50.42,32.38 v51.05,31.75
SCL
  Top 0.254: U2.SCL JP3.10
SD_CS_3.3V  (via drill 0.51)
  Top 0.254: R5.1 47.84,40.98 47.5,40.64 45.97,40.64 45.21,39.88 45.21,34.8 46.35,33.66 U3.4 v48.77,33.66 | U4.2 11.65,13.75 12.7,12.7 v12.7,6.35
  Bottom 0.254: v48.77,33.66 51.44,33.66 52.07,33.02 52.07,28.7 49.78,26.42 37.34,26.42 35.56,24.64 35.56,21.84 32.51,18.8 29.97,18.8 26.67,22.1 15.24,22.1 12.7,19.56 v12.7,6.35
SD_CS_5V  (via drill 0.51)
  Top 0.254: v48.77,34.92 U3.5 | U2.D8 JP3.1 33.02,44.45 33.53,43.94 v43.18,43.94
  Bottom 0.254: v43.18,43.94 42.16,42.93 42.16,39.62 42.67,39.12 46.48,39.12 48.26,40.89 49.28,40.89 50.55,39.62 52.07,39.62 52.58,39.12 52.58,37.59 49.91,34.92 v48.77,34.92
SDA
  Top 0.254: U2.SDA JP3.9
VIN
  Bottom 0.508: JP5.4 10.16,5.84 11.68,4.32 35.05,4.32 U2.VIN
WIFI_MISO
  Top 0.254: U5.P$13 35.79,15.77 35.05,16.51 35.05,25.65 36.07,26.67 48.01,26.67 49.28,25.4 50.55,25.4 50.8,25.15 U6.2
WIFI_RX
  Top 0.254: U5.P$8 41.45,21.8 40.64,22.61 JP1.2
WIFI_TX  (via drill 0.51)
  Top 0.254: U5.P$6 v43.85,21.46
  Bottom 0.254: v43.85,21.46 43.81,21.46 43.18,22.1 JP1.1

### Text on the board
Bottom: v10
tPlace: SCL | SDA | AREF | GND | 13 | 12 | 11 | 10 | 9 | 8 | 7 | 6 | 5 | 4 | 3 | 2 | TX | RX | CC3000 | SCK | MISO | MOSI | CS | SDCS | EN | INT | WiFi Shield | Debug | GND | RX | TX | Mode | 3.3V | 5V | GND | VIN | ISP | Antenna / Select | 802.11b/g | U.FL | Analog In | Reset | IOREF | RST | 3.3V | 5V | GND | GND | VIN | A0 | A1 | A2 | A3 | A4 | A5 | PWR
tDocu: Shawn Hymel